# Altium project SmartWater.PrjPcb
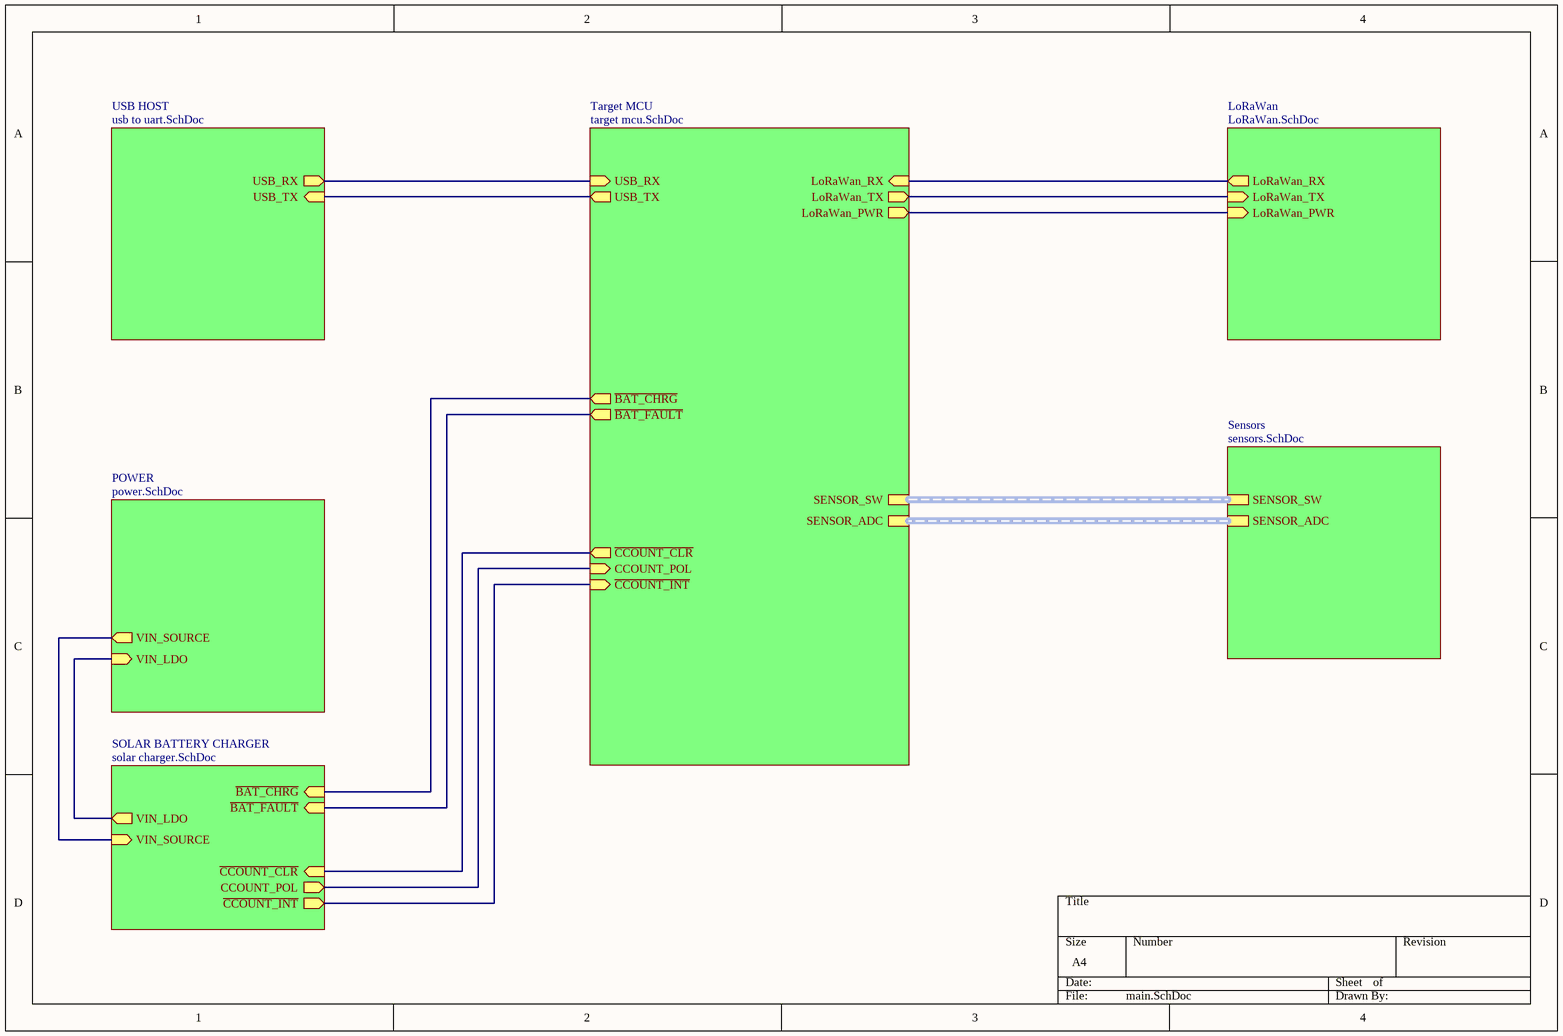
[diagram p0: main.SchDoc]
7 sheets, 122 parts. Net scope: hierarchical (ports join the sheet entries above them; power ports are global).
Board file: main.PcbDoc
Sheets:
  main.SchDoc
    Target MCU = target mcu.SchDoc
    USB HOST = usb to uart.SchDoc
    Sensors = sensors.SchDoc
    LoRaWan = LoRaWan.SchDoc
    POWER = power.SchDoc
    SOLAR BATTERY CHARGER = solar charger.SchDoc

## Sheet main.SchDoc
size A4

### Sub-sheets
LoRaWan = LoRaWan.SchDoc: LoRaWan_TX (in), LoRaWan_RX (out), LoRaWan_PWR (in)
POWER = power.SchDoc: VIN_SOURCE (out), VIN_LDO (in)
Sensors = sensors.SchDoc: SENSOR_ADC (harness SENSOR ADC), SENSOR_SW (harness SENSOR SWITCH)
SOLAR BATTERY CHARGER = solar charger.SchDoc: ~{CCOUNT_CLR} (in), ~{CCOUNT_INT} (out), VIN_SOURCE (in), VIN_LDO (out), ~{BAT_CHRG} (in), CCOUNT_POL (out), ~{BAT_FAULT} (in)
Target MCU = target mcu.SchDoc: SENSOR_SW (harness SENSOR SWITCH), LoRaWan_RX (in), SENSOR_ADC (harness SENSOR ADC), USB_TX (out), LoRaWan_TX (out), USB_RX (in), LoRaWan_PWR (out), ~{CCOUNT_CLR} (out), CCOUNT_POL (in), ~{CCOUNT_INT} (in), ~{BAT_CHRG} (out), ~{BAT_FAULT} (out)
USB HOST = usb to uart.SchDoc: USB_RX (out), USB_TX (in)

### Nets
CCOUNT+: sheet POWER/VIN_LDO, sheet SOLAR BATTERY CHARGER/VIN_LDO
CLR: sheet Target MCU/~{CCOUNT_CLR}, sheet SOLAR BATTERY CHARGER/~{CCOUNT_CLR}
INT: sheet Target MCU/~{CCOUNT_INT}, sheet SOLAR BATTERY CHARGER/~{CCOUNT_INT}
LoRa_RX: sheet Target MCU/LoRaWan_RX, sheet LoRaWan/LoRaWan_RX
LoRa_TX: sheet Target MCU/LoRaWan_TX, sheet LoRaWan/LoRaWan_TX
POL: sheet Target MCU/CCOUNT_POL, sheet SOLAR BATTERY CHARGER/CCOUNT_POL
Net*1_1: sheet Target MCU/LoRaWan_PWR, sheet LoRaWan/LoRaWan_PWR
NetC37_2: sheet POWER/VIN_SOURCE, sheet SOLAR BATTERY CHARGER/VIN_SOURCE
NetU1_1: sheet Target MCU/USB_RX, sheet USB HOST/USB_RX
NetU1_38: sheet Target MCU/~{BAT_FAULT}, sheet SOLAR BATTERY CHARGER/~{BAT_FAULT}
NetU1_39: sheet Target MCU/~{BAT_CHRG}, sheet SOLAR BATTERY CHARGER/~{BAT_CHRG}
NetU1_48: sheet Target MCU/USB_TX, sheet USB HOST/USB_TX

### Buses and harness runs
harness sheet Sensors/SENSOR_ADC = sheet Target MCU/SENSOR_ADC
harness sheet Sensors/SENSOR_SW = sheet Target MCU/SENSOR_SW

## Sheet target mcu.SchDoc
size A4
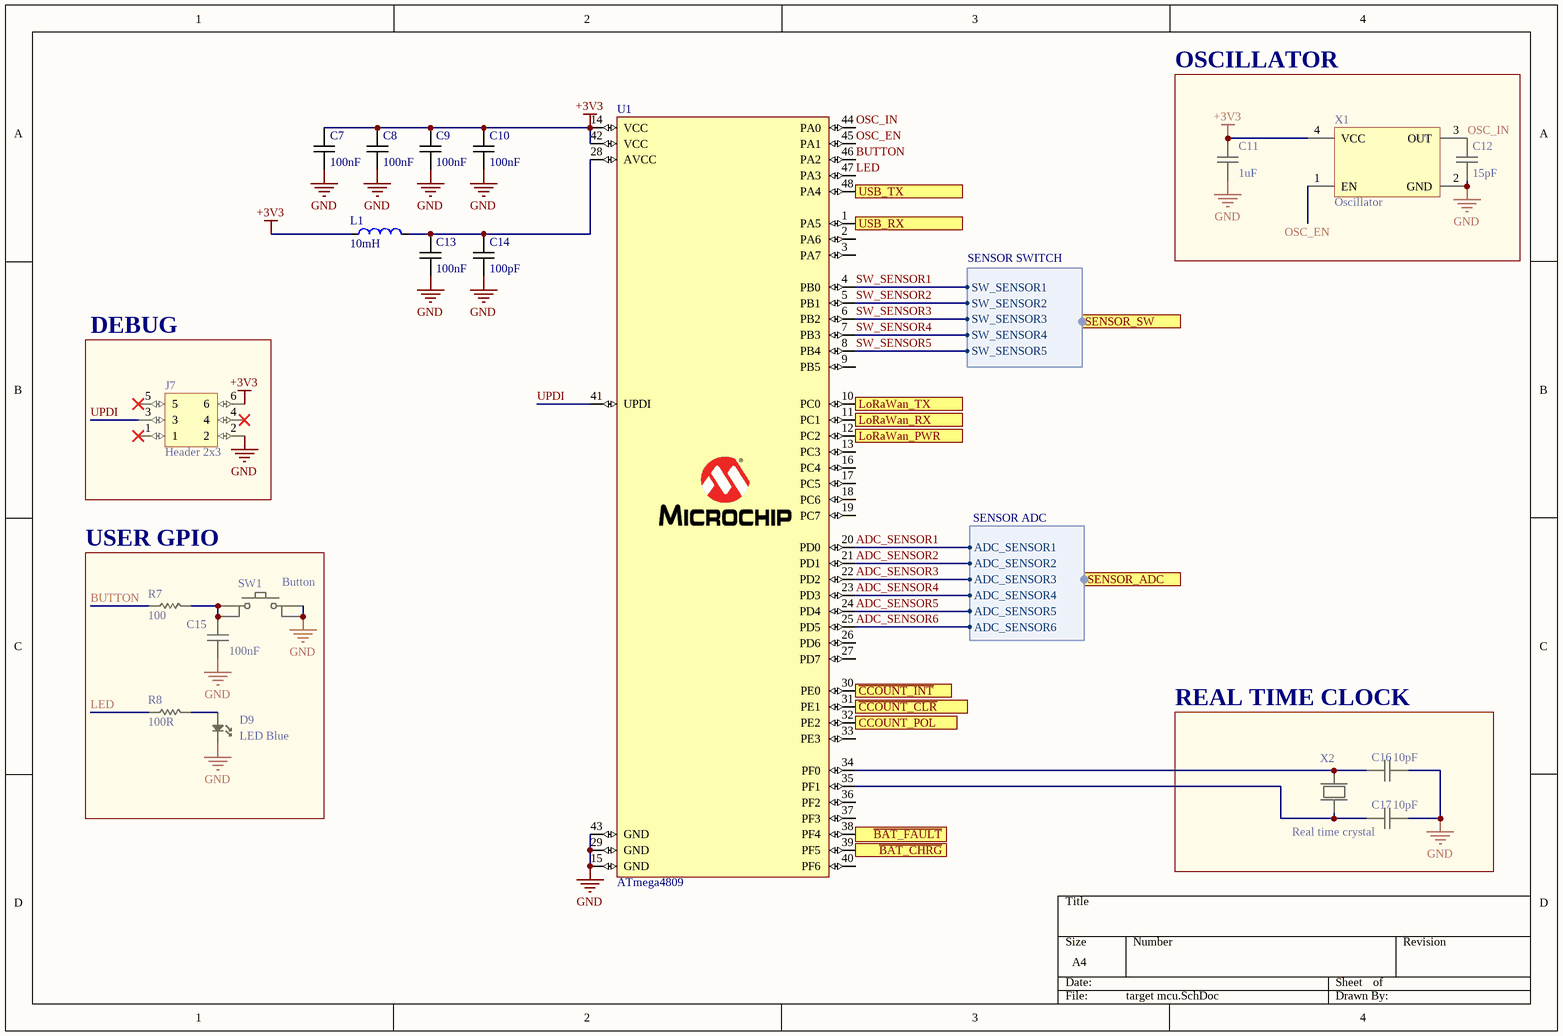
[diagram p1: target mcu.SchDoc]

### Parts
C7  value 100nF  [C0402]  (hidden comment: Capacitor 0402)
C8  value 100nF  [C0402]  (hidden comment: Capacitor 0402)
C9  value 100nF  [C0402]  (hidden comment: Capacitor 0402)
C10  value 100nF  [C0402]  (hidden comment: Capacitor 0402)
C11  value 1uF  [C0603]  (hidden comment: Capacitor 0603)
C12  value 15pF  [C0603]  (hidden comment: Capacitor 0603)
C13  value 100nF  [C0402]  (hidden comment: Capacitor 0402)
C14  value 100pF  [C0402]  (hidden comment: Capacitor 0402)
C15  value 100nF  [C0603]  (hidden comment: Capacitor 0603)
C16  value 10pF  [C0603]  (hidden comment: Capacitor 0603)
C17  value 10pF  [C0603]  (hidden comment: Capacitor 0603)
D9  LED Blue  [L0603 BLUE]
J7  Header 2x3  [Header 2x3 Male]
L1  value 10mH  [Inductor 0603]  (hidden comment: Inductor 0603)
R7  value 100  [R0603]  (hidden comment: Resistor 0603)
R8  value 100R  [R0603]  (hidden comment: Resistor 0603)
SW1  Button  [Button SMD]
U1  ATmega4809  [ATmega4809]
X1  Oscillator  [Crystal SMD 3.2x2.5]
X2  Real time crystal  [Realtime crystal SMD 4.2x1.45mm]

### Blocks framed on the sheet
OSCILLATOR: C11 C12 X1
DEBUG: J7
USER GPIO: C15 D9 R7 R8 SW1
REAL TIME CLOCK: C16 C17 X2

### Ports
CCOUNT_POL (in), LoRaWan_PWR (out), LoRaWan_RX (in), LoRaWan_TX (out), SENSOR_ADC (harness SENSOR ADC), SENSOR_SW (harness SENSOR SWITCH), USB_RX (in), USB_TX (out), ~{BAT_CHRG} (out), ~{BAT_FAULT} (out), ~{CCOUNT_CLR} (out), ~{CCOUNT_INT} (in)

### Harnesses
SENSOR SWITCH: SW_SENSOR1, SW_SENSOR2, SW_SENSOR3, SW_SENSOR4, SW_SENSOR5
SENSOR ADC: ADC_SENSOR1, ADC_SENSOR2, ADC_SENSOR3, ADC_SENSOR4, ADC_SENSOR5, ADC_SENSOR6

### Nets
+3V3: C7.2 C8.2 C9.2 C10.2 C11.2 J7.6 L1.1 U1.14(VCC) U1.42(VCC) X1.4(VCC)
GND: C7.1 C8.1 C9.1 C10.1 C11.1 C12.1 C13.1 C14.1 C15.1 C16.2 C17.2 D9.2 J7.2 SW1.3 SW1.4 U1.15(GND) U1.29(GND) U1.43(GND) X1.2(GND)
ADC_SENSOR1: U1.20(PD0) ; port SENSOR_ADC.ADC_SENSOR1
ADC_SENSOR2: U1.21(PD1) ; port SENSOR_ADC.ADC_SENSOR2
ADC_SENSOR3: U1.22(PD2) ; port SENSOR_ADC.ADC_SENSOR3
ADC_SENSOR4: U1.23(PD3) ; port SENSOR_ADC.ADC_SENSOR4
ADC_SENSOR5: U1.24(PD4) ; port SENSOR_ADC.ADC_SENSOR5
ADC_SENSOR6: U1.25(PD5) ; port SENSOR_ADC.ADC_SENSOR6
BUTTON: R7.1 U1.46(PA2)
CLR: U1.31(PE1) ; port ~{CCOUNT_CLR}
INT: U1.30(PE0) ; port ~{CCOUNT_INT}
LED: R8.1 U1.47(PA3)
LoRa_RX: U1.11(PC1) ; port LoRaWan_RX
LoRa_TX: U1.10(PC0) ; port LoRaWan_TX
OSC_EN: U1.45(PA1) X1.1(EN)
OSC_IN: C12.2 U1.44(PA0) X1.3(OUT)
POL: U1.32(PE2) ; port CCOUNT_POL
SW_SENSOR1: U1.4(PB0) ; port SENSOR_SW.SW_SENSOR1
SW_SENSOR2: U1.5(PB1) ; port SENSOR_SW.SW_SENSOR2
SW_SENSOR3: U1.6(PB2) ; port SENSOR_SW.SW_SENSOR3
SW_SENSOR4: U1.7(PB3) ; port SENSOR_SW.SW_SENSOR4
SW_SENSOR5: U1.8(PB4) ; port SENSOR_SW.SW_SENSOR5
UPDI: J7.3 U1.41(UPDI)
Net*1_1: U1.12(PC2) ; port LoRaWan_PWR
NetC13_2: C13.2 C14.2 L1.2 U1.28(AVCC)
NetC15_2: C15.2 R7.2 SW1.1 SW1.2
NetC16_1: C16.1 U1.34(PF0) X2.2
NetC17_1: C17.1 U1.35(PF1) X2.1
NetD9_1: D9.1 R8.2
NetU1_1: U1.1(PA5) ; port USB_RX
NetU1_38: U1.38(PF4) ; port ~{BAT_FAULT}
NetU1_39: U1.39(PF5) ; port ~{BAT_CHRG}
NetU1_48: U1.48(PA4) ; port USB_TX

Not connected (* = marked no-connect by the designer): J7 1* 4* 5*; U1 2(PA6) 3(PA7) 9(PB5) 13(PC3) 16(PC4) 17(PC5) 18(PC6) 19(PC7) 26(PD6) 27(PD7) 33(PE3) 36(PF2) 37(PF3) 40(PF6)

### Library data of the parts
D9 = LED 0603 Blue
J7 = Header  2x3 Male
SW1 = Button SMD
X1 = Oscillator 3.2x2.5mm
X2 = Realtime crystal SMD 5.2x1.45mm

## Sheet usb to uart.SchDoc
size A4
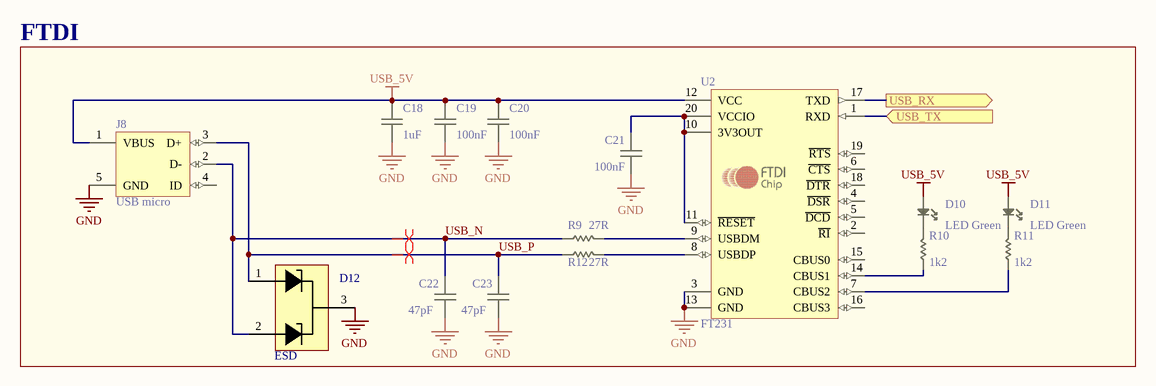
[diagram p2: usb to uart.SchDoc]

### Parts
C18  value 1uF  [C0603]  (hidden comment: Capacitor 0603)
C19  value 100nF  [C0603]  (hidden comment: Capacitor 0603)
C20  value 100nF  [C0603]  (hidden comment: Capacitor 0603)
C21  value 100nF  [C0603]  (hidden comment: Capacitor 0603)
C22  value 47pF  [C0603]  (hidden comment: Capacitor 0603)
C23  value 47pF  [C0603]  (hidden comment: Capacitor 0603)
D10  LED Green  [L0603 GREEN]
D11  LED Green  [L0603 GREEN]
D12  ESD  [ESD protection]
J8  USB micro  [USB micro]
R9  value 27R  [R0603]  (hidden comment: Resistor 0603)
R10  value 1k2  [R0603]  (hidden comment: Resistor 0603)
R11  value 1k2  [R0603]  (hidden comment: Resistor 0603)
R12  value 27R  [R0603]  (hidden comment: Resistor 0603)
U2  FT231  [FTDI]

### Blocks framed on the sheet
FTDI: C18-C23 D10-D12 J8 R9-R12 U2

### Ports
USB_RX (out), USB_TX (in)

### Nets
GND: C18.1 C19.1 C20.1 C21.1 C22.1 C23.1 D12.3 J8.5(GND) U2.3(GND) U2.13(GND)
USB_5V: C18.2 C19.2 C20.2 D10.1 D11.1 J8.1(VBUS) U2.12(VCC)
USB_N: C22.2 D12.2 J8.2(D-) R9.1
USB_P: C23.2 D12.1 J8.3(D+) R12.1
NetC21_2: C21.2 U2.10(3V3OUT) U2.11(~{RESET}) U2.20(VCCIO)
NetD10_2: D10.2 R10.2
NetD11_2: D11.2 R11.2
NetR9_2: R9.2 U2.9(USBDM)
NetR10_1: R10.1 U2.14(CBUS1)
NetR11_1: R11.1 U2.7(CBUS2)
NetR12_2: R12.2 U2.8(USBDP)
NetU1_1: U2.17(TXD) ; port USB_RX
NetU1_48: U2.1(RXD) ; port USB_TX

Not connected (* = marked no-connect by the designer): J8 4(ID); U2 2(~{RI}) 4(~{DSR}) 5(~{DCD}) 6(~{CTS}) 15(CBUS0) 16(CBUS3) 18(~{DTR}) 19(~{RTS})

### Layout directives
differential pair: USB_N, USB_P

### Library data of the parts
D10 D11 = LED 0603 Green
D12 = ESD protection 3.3V: PESD3V3S2UAT
U2 = FTDI: USB to UART

## Sheet sensors.SchDoc
size A4
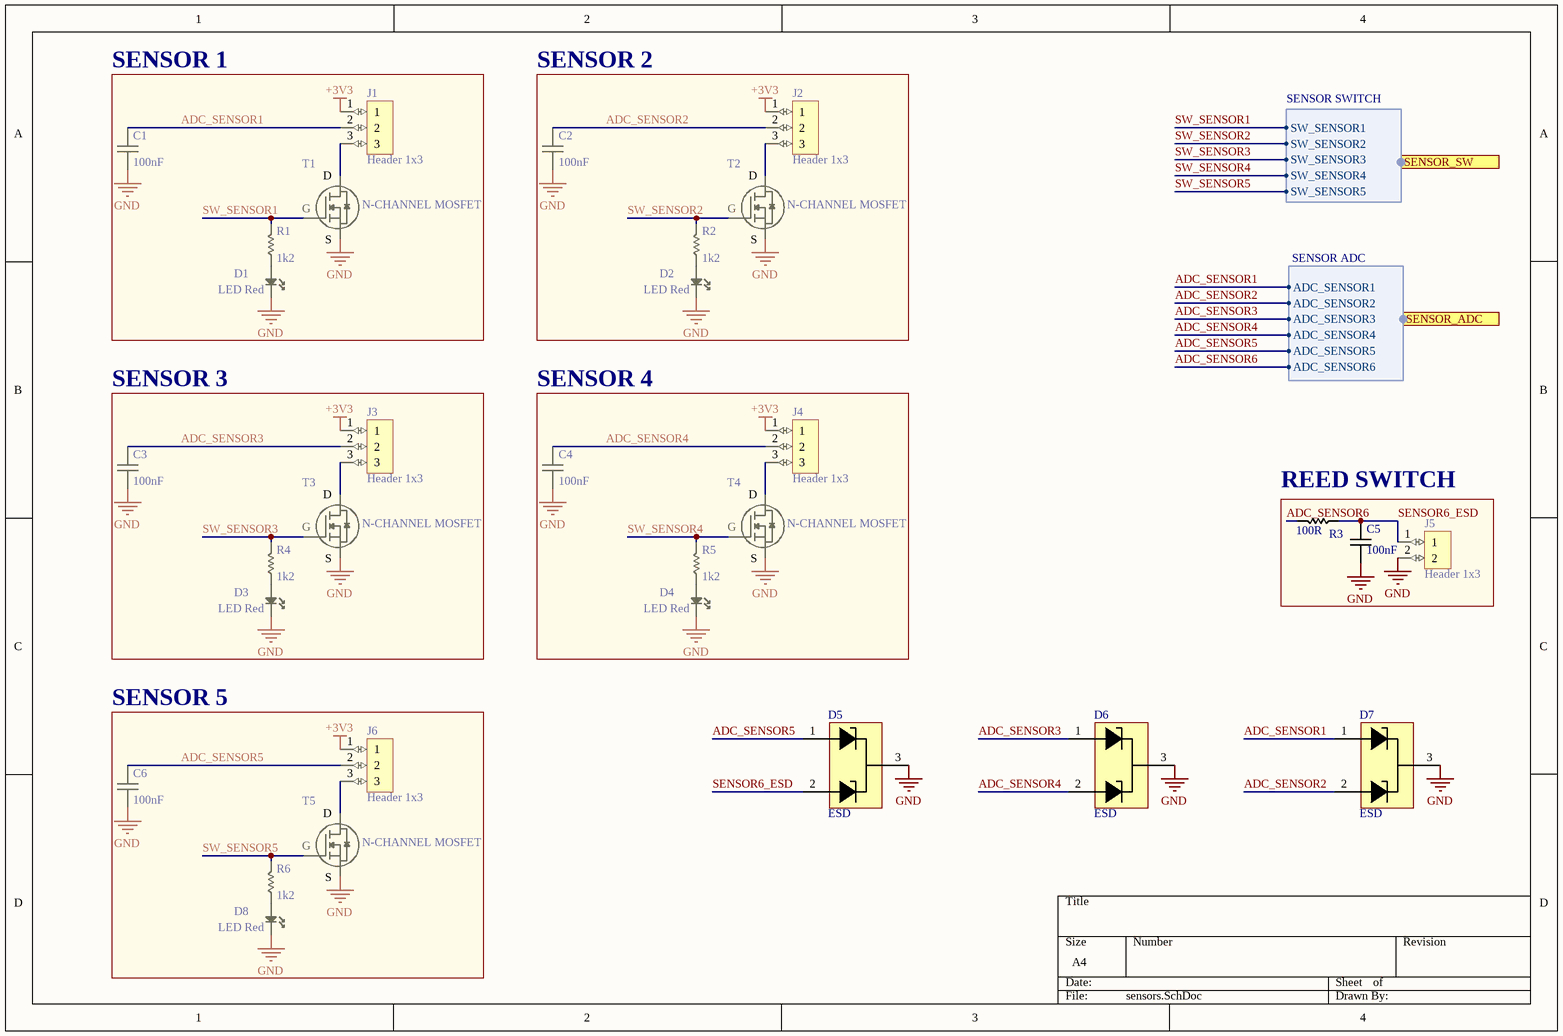
[diagram p3: sensors.SchDoc]

### Parts
C1  value 100nF  [C0402]  (hidden comment: Capacitor 0402)
C2  value 100nF  [C0402]  (hidden comment: Capacitor 0402)
C3  value 100nF  [C0402]  (hidden comment: Capacitor 0402)
C4  value 100nF  [C0402]  (hidden comment: Capacitor 0402)
C5  value 100nF  [C0603]  (hidden comment: Capacitor 0603)
C6  value 100nF  [C0402]  (hidden comment: Capacitor 0402)
D1  LED Red  [L0603 RED]
D2  LED Red  [L0603 RED]
D3  LED Red  [L0603 RED]
D4  LED Red  [L0603 RED]
D5  ESD  [ESD protection]
D6  ESD  [ESD protection]
D7  ESD  [ESD protection]
D8  LED Red  [L0603 RED]
J1  Header 1x3  [Header 1x3 Male JST]
J2  Header 1x3  [Header 1x3 Male JST]
J3  Header 1x3  [Header 1x3 Male JST]
J4  Header 1x3  [Header 1x3 Male JST]
J5  Header 1x3  [HEADER 1X2 MALE JST]
J6  Header 1x3  [Header 1x3 Male JST]
R1  value 1k2  [R0603]  (hidden comment: Resistor 0603)
R2  value 1k2  [R0603]  (hidden comment: Resistor 0603)
R3  value 100R  [R0603]  (hidden comment: Resistor 0603)
R4  value 1k2  [R0603]  (hidden comment: Resistor 0603)
R5  value 1k2  [R0603]  (hidden comment: Resistor 0603)
R6  value 1k2  [R0603]  (hidden comment: Resistor 0603)
T1  N-CHANNEL MOSFET  [2N7002]
T2  N-CHANNEL MOSFET  [2N7002]
T3  N-CHANNEL MOSFET  [2N7002]
T4  N-CHANNEL MOSFET  [2N7002]
T5  N-CHANNEL MOSFET  [2N7002]

### Blocks framed on the sheet
SENSOR 1: C1 D1 J1 R1 T1
SENSOR 2: C2 D2 J2 R2 T2
SENSOR 3: C3 D3 J3 R4 T3
SENSOR 4: C4 D4 J4 R5 T4
REED SWITCH: C5 J5 R3
SENSOR 5: C6 D8 J6 R6 T5

### Ports
SENSOR_ADC (harness SENSOR ADC), SENSOR_SW (harness SENSOR SWITCH)

### Harnesses
SENSOR SWITCH: SW_SENSOR1, SW_SENSOR2, SW_SENSOR3, SW_SENSOR4, SW_SENSOR5
SENSOR ADC: ADC_SENSOR1, ADC_SENSOR2, ADC_SENSOR3, ADC_SENSOR4, ADC_SENSOR5, ADC_SENSOR6

### Nets
+3V3: J1.1 J2.1 J3.1 J4.1 J6.1
GND: C1.1 C2.1 C3.1 C4.1 C5.1 C6.1 D1.2 D2.2 D3.2 D4.2 D5.3 D6.3 D7.3 D8.2 J5.2 T1.2(S) T2.2(S) T3.2(S) T4.2(S) T5.2(S)
ADC_SENSOR1: C1.2 D7.1 J1.2 ; port SENSOR_ADC.ADC_SENSOR1
ADC_SENSOR2: C2.2 D7.2 J2.2 ; port SENSOR_ADC.ADC_SENSOR2
ADC_SENSOR3: C3.2 D6.1 J3.2 ; port SENSOR_ADC.ADC_SENSOR3
ADC_SENSOR4: C4.2 D6.2 J4.2 ; port SENSOR_ADC.ADC_SENSOR4
ADC_SENSOR5: C6.2 D5.1 J6.2 ; port SENSOR_ADC.ADC_SENSOR5
ADC_SENSOR6: R3.2 ; port SENSOR_ADC.ADC_SENSOR6
SENSOR6_ESD: C5.2 D5.2 J5.1 R3.1
SW_SENSOR1: R1.2 T1.1(G) ; port SENSOR_SW.SW_SENSOR1
SW_SENSOR2: R2.2 T2.1(G) ; port SENSOR_SW.SW_SENSOR2
SW_SENSOR3: R4.2 T3.1(G) ; port SENSOR_SW.SW_SENSOR3
SW_SENSOR4: R5.2 T4.1(G) ; port SENSOR_SW.SW_SENSOR4
SW_SENSOR5: R6.2 T5.1(G) ; port SENSOR_SW.SW_SENSOR5
NetD1_1: D1.1 R1.1
NetD2_1: D2.1 R2.1
NetD3_1: D3.1 R4.1
NetD4_1: D4.1 R5.1
NetD8_1: D8.1 R6.1
NetJ1_3: J1.3 T1.3(D)
NetJ2_3: J2.3 T2.3(D)
NetJ3_3: J3.3 T3.3(D)
NetJ4_3: J4.3 T4.3(D)
NetJ6_3: J6.3 T5.3(D)

### Library data of the parts
D1-D4 D8 = LED 0603 Red
D5-D7 = ESD protection 3.3V: PESD3V3S2UAT
J1-J4 J6 = Header 1x3 Male
J5 = Header 1x2 Male
T1-T5 = 2N7002

## Sheet LoRaWan.SchDoc
size A4
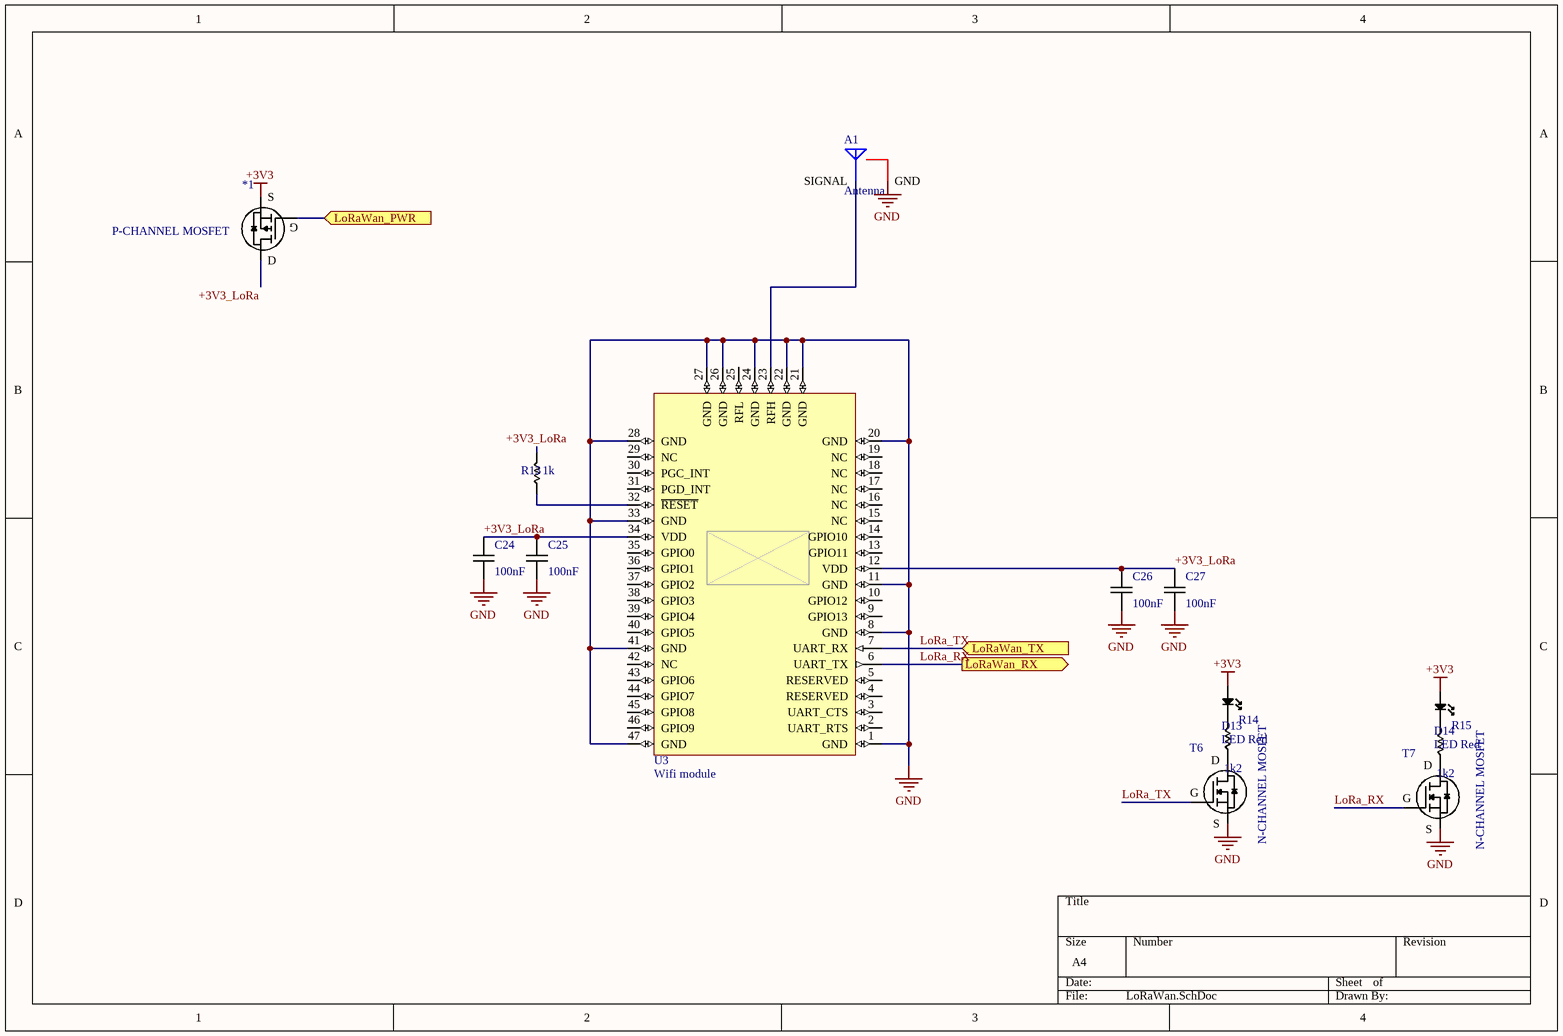
[diagram p4: LoRaWan.SchDoc]

### Parts
*1  P-CHANNEL MOSFET  [P-CHANNEL MOSFET]
A1  Antenna  [uFL SMD]
C24  value 100nF  [C0603]  (hidden comment: Capacitor 0603)
C25  value 100nF  [C0603]  (hidden comment: Capacitor 0603)
C26  value 100nF  [C0603]  (hidden comment: Capacitor 0603)
C27  value 100nF  [C0603]  (hidden comment: Capacitor 0603)
D13  LED Red  [L0603 RED]
D14  LED Red  [L0603 RED]
R13  value 1k  [R0603]  (hidden comment: Resistor 0603)
R14  value 1k2  [R0603]  (hidden comment: Resistor 0603)
R15  value 1k2  [R0603]  (hidden comment: Resistor 0603)
T6  N-CHANNEL MOSFET  [2N7002]
T7  N-CHANNEL MOSFET  [2N7002]
U3  Wifi module  [RN2483A]

### Ports
LoRaWan_PWR (in), LoRaWan_RX (out), LoRaWan_TX (in)

### Nets
+3V3: *1.2(S) D13.1 D14.1
GND: A1.2(GND) C24.1 C25.1 C26.1 C27.1 T6.2(S) T7.2(S) U3.1(GND) U3.8(GND) U3.11(GND) U3.20(GND) U3.21(GND) U3.22(GND) U3.24(GND) U3.26(GND) U3.27(GND) U3.28(GND) U3.33(GND) U3.41(GND) U3.47(GND)
+3V3_LoRa: *1.3(D) C24.2 C25.2 C26.2 C27.2 R13.2 U3.12(VDD) U3.34(VDD)
LoRa_RX: T7.1(G) U3.6(UART_TX) ; port LoRaWan_RX
LoRa_TX: T6.1(G) U3.7(UART_RX) ; port LoRaWan_TX
Net*1_1: *1.1(G) ; port LoRaWan_PWR
NetA1_1: A1.1(SIGNAL) U3.23(RFH)
NetD13_2: D13.2 R14.2
NetD14_2: D14.2 R15.2
NetR13_1: R13.1 U3.32(~{RESET})
NetR14_1: R14.1 T6.3(D)
NetR15_1: R15.1 T7.3(D)

Not connected (* = marked no-connect by the designer): U3 2(UART_RTS) 3(UART_CTS) 4(RESERVED) 5(RESERVED) 9(GPIO13) 10(GPIO12) 13(GPIO11) 14(GPIO10) 15(NC) 16(NC) 17(NC) 18(NC) 19(NC) 25(RFL) 29(NC) 30(PGC_INT) 31(PGD_INT) 35(GPIO0) 36(GPIO1) 37(GPIO2) 38(GPIO3) 39(GPIO4) 40(GPIO5) 42(NC) 43(GPIO6) 44(GPIO7) 45(GPIO8) 46(GPIO9)

### Library data of the parts
A1 = uFL SMD
D13 D14 = LED 0603 Red
T6 T7 = 2N7002
U3 = LoRaWan module: RN2483A

## Sheet power.SchDoc
size A4
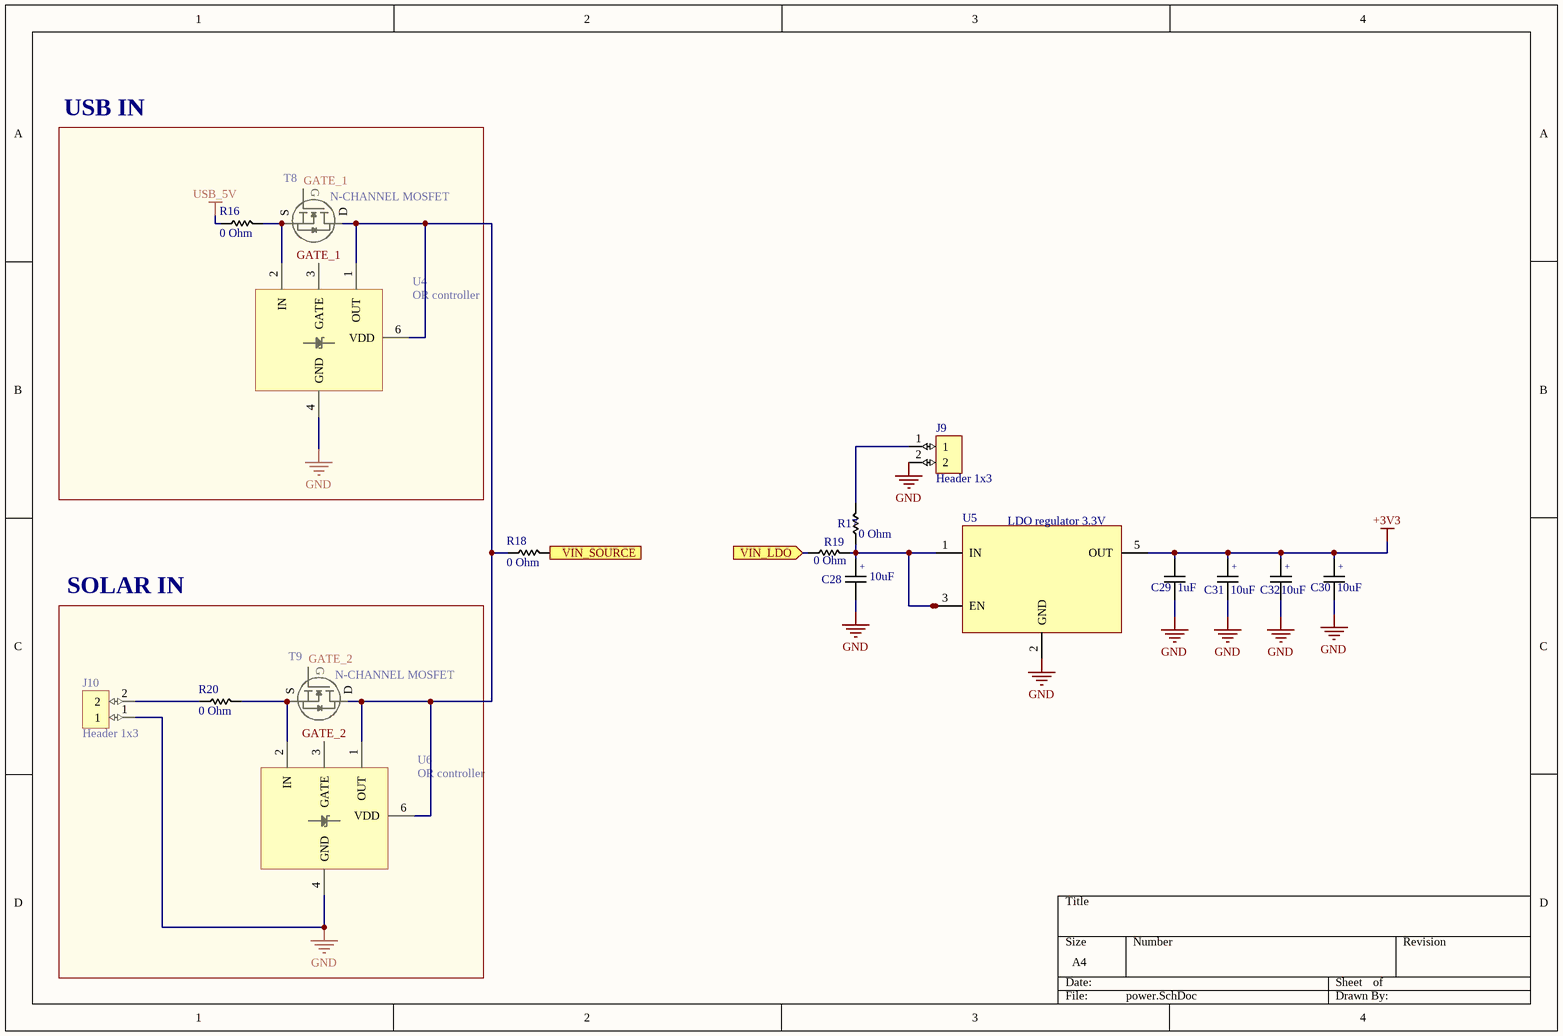
[diagram p5: power.SchDoc]

### Parts
C28  value 10uF  [Capacitor electrolytic SMD 4x5.4]  (hidden comment: El. Capacitor SMD 4x5.4)
C29  value 1uF  [C0603]  (hidden comment: Capacitor 0603)
C30  value 10uF  [Capacitor electrolytic SMD 4x5.4]  (hidden comment: El. Capacitor SMD 4x5.4)
C31  value 10uF  [Capacitor electrolytic SMD 4x5.4]  (hidden comment: El. Capacitor SMD 4x5.4)
C32  value 10uF  [Capacitor electrolytic SMD 4x5.4]  (hidden comment: El. Capacitor SMD 4x5.4)
J9  Header 1x3  [HEADER 1X2 MALE JST]
J10  Header 1x3  [Header 1x2 Male]
R16  value 0 Ohm  [R0603]  (hidden comment: Resistor 0603)
R17  value 0 Ohm  [R0603]  (hidden comment: Resistor 0603)
R18  value 0 Ohm  [R0603]  (hidden comment: Resistor 0603)
R19  value 0 Ohm  [R0603]  (hidden comment: Resistor 0603)
R20  value 0 Ohm  [R0603]  (hidden comment: Resistor 0603)
T8  N-CHANNEL MOSFET  [N-CHANNEL MOSFET]
T9  N-CHANNEL MOSFET  [N-CHANNEL MOSFET]
U4  OR controller  [DFN 6-pins]
U5  LDO regulator 3.3V  [LDO 5-pin SOT]
U6  OR controller  [DFN 6-pins]

### Blocks framed on the sheet
USB IN: R16 T8 U4
SOLAR IN: J10 R20 T9 U6

### Ports
VIN_LDO (in), VIN_SOURCE (out)

### Nets
+3V3: C29.2 C30.1 C31.1 C32.1 U5.5(OUT)
GND: C28.2 C29.1 C30.2 C31.2 C32.2 J9.2 J10.1 U4.4(GND) U5.2(GND) U6.4(GND)
USB_5V: R16.1
CCOUNT+: R19.1 ; port VIN_LDO
GATE_1: T8.1(G) U4.3(GATE)
GATE_2: T9.1(G) U6.3(GATE)
NetC28_1: C28.1 R17.1 R19.2 U5.1(IN) U5.3(EN)
NetC37_2: R18.2 ; port VIN_SOURCE
NetJ9_1: J9.1 R17.2
NetJ10_2: J10.2 R20.1
NetR16_2: R16.2 T8.2(S) U4.2(IN)
NetR18_1: R18.1 T8.3(D) T9.3(D) U4.1(OUT) U4.6(VDD) U6.1(OUT) U6.6(VDD)
NetR20_2: R20.2 T9.2(S) U6.2(IN)

### Notes on the sheet
- (in symbol El. Capacitor SMD 4x5.4) +

### Library data of the parts
J9 J10 = Header 1x2 Male
U4 U6 = OR controller: LTC4357
U5 = TLV700 - 3.3V

## Sheet solar charger.SchDoc
size A4
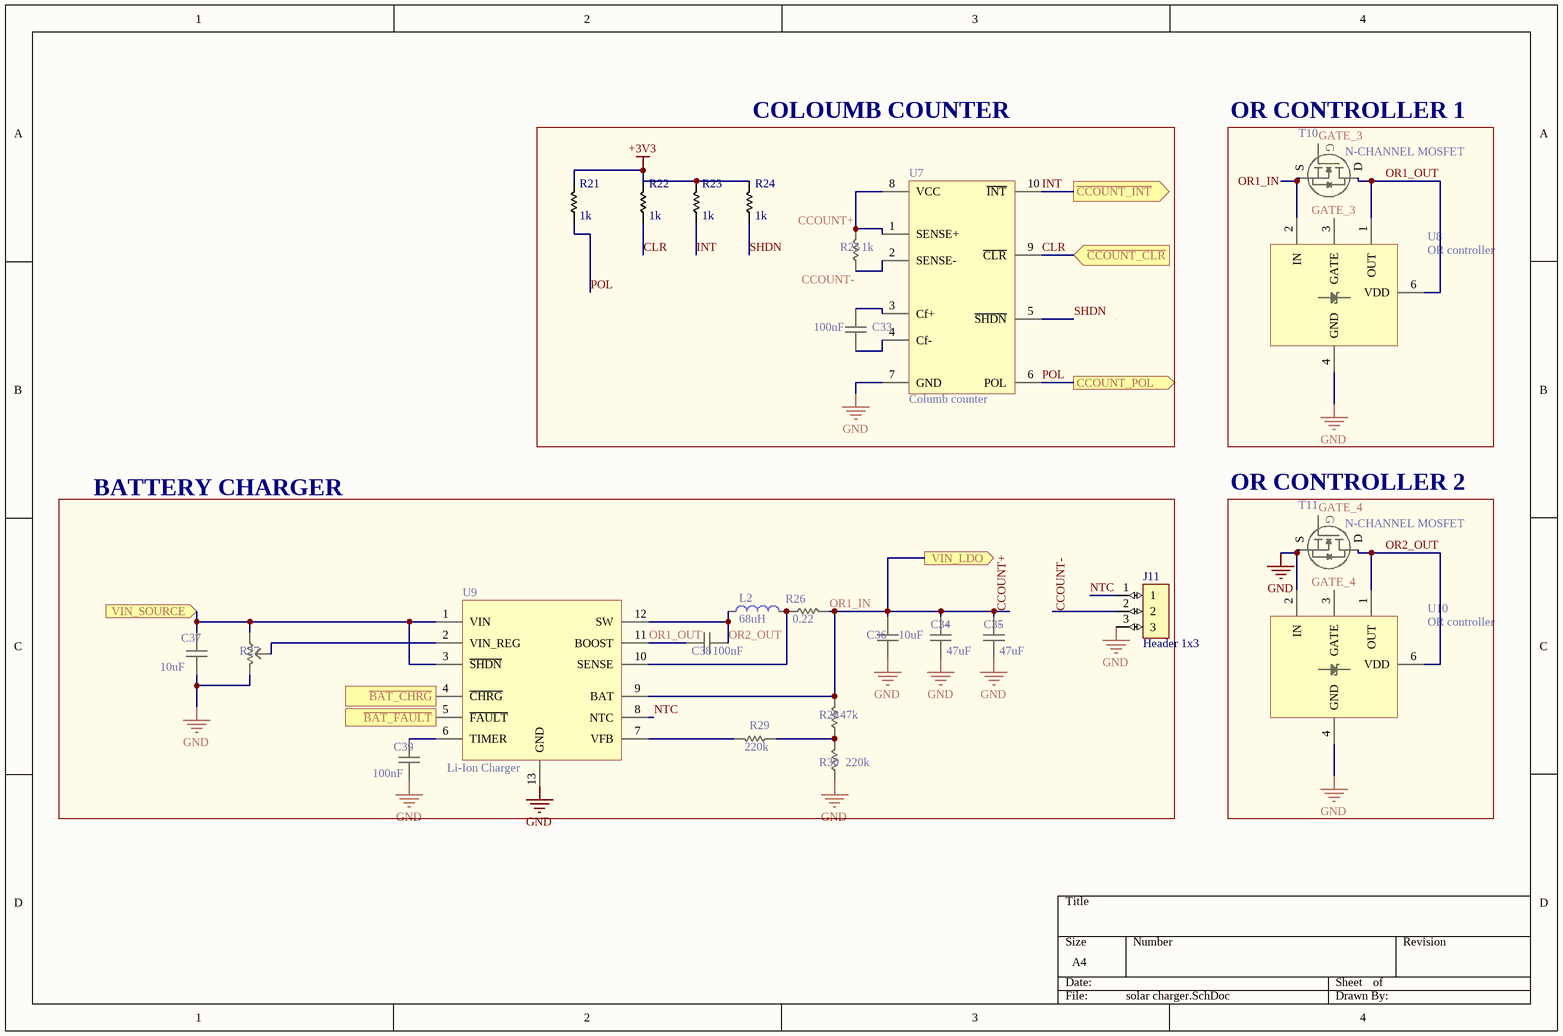
[diagram p6: solar charger.SchDoc]

### Parts
C33  value 100nF  [C0603]  (hidden comment: Capacitor 0603)
C34  value 47uF  [Capacitor electrolytic SMD 5x5.4]  (hidden comment: El. Capacitor SMD 5x5.4)
C35  value 47uF  [Capacitor electrolytic SMD 5x5.4]  (hidden comment: El. Capacitor SMD 5x5.4)
C36  value 10uF  [C0805]  (hidden comment: Capacitor 0805)
C37  value 10uF  [C0805]  (hidden comment: Capacitor 0805)
C38  value 100nF  [C0603]  (hidden comment: Capacitor 0603)
C39  value 100nF  [C0603]  (hidden comment: Capacitor 0603)
J11  Header 1x3  [Header 1x3 Male JST]
L2  value 68uH  [Inductor 1515]  (hidden comment: Inductor 1515)
R21  value 1k  [R0603]  (hidden comment: Resistor 0603)
R22  value 1k  [R0603]  (hidden comment: Resistor 0603)
R23  value 1k  [R0603]  (hidden comment: Resistor 0603)
R24  value 1k  [R0603]  (hidden comment: Resistor 0603)
R25  value 1k  [R0603]  (hidden comment: Resistor 0603)
R26  value 0.22  [R0603]  (hidden comment: Resistor 0603)
R27  Potentiometer  [Potentiometer 0505]  (value not drawn)
R28  value 47k  [R0603]  (hidden comment: Resistor 0603)
R29  value 220k  [R0603]  (hidden comment: Resistor 0603)
R30  value 220k  [R0603]  (hidden comment: Resistor 0603)
T10  N-CHANNEL MOSFET  [N-CHANNEL MOSFET]
T11  N-CHANNEL MOSFET  [N-CHANNEL MOSFET]
U7  Columb counter  [LTC4150]
U8  OR controller  [DFN 6-pins]
U9  Li-Ion Charger  [DFN 12-PINS]
U10  OR controller  [DFN 6-pins]

### Blocks framed on the sheet
COLOUMB COUNTER: C33 R21-R25 U7
OR CONTROLLER 1: T10 U8
BATTERY CHARGER: C34-C39 J11 L2 R26-R30 U9
OR CONTROLLER 2: T11 U10

### Ports
CCOUNT_POL (out), VIN_LDO (out), VIN_SOURCE (in), ~{BAT_CHRG} (in), ~{BAT_FAULT} (in), ~{CCOUNT_CLR} (in), ~{CCOUNT_INT} (out)

### Nets
+3V3: R21.2 R22.2 R23.2 R24.2
GND: C34.2 C35.2 C36.1 C37.1 C39.1 J11.3 R27.3 R30.1 T11.2(S) U7.7(GND) U8.4(GND) U9.13(GND) U10.2(IN) U10.4(GND)
CCOUNT+: C34.1 C35.1 C36.2 R25.2 R26.2 R28.2 T10.2(S) U7.1(SENSE+) U7.8(VCC) U8.2(IN) U9.9(BAT) ; port VIN_LDO  [also labelled OR1_IN]
CCOUNT-: J11.2 R25.1 U7.2(SENSE-)
CLR: R22.1 U7.9(~{CLR}) ; port ~{CCOUNT_CLR}
GATE_3: T10.1(G) U8.3(GATE)
GATE_4: T11.1(G) U10.3(GATE)
INT: R23.1 U7.10(~{INT}) ; port ~{CCOUNT_INT}
NTC: J11.1 U9.8(NTC)
OR1_OUT: C38.1 T10.3(D) U8.1(OUT) U8.6(VDD) U9.11(BOOST)
OR2_OUT: C38.2 L2.1 T11.3(D) U9.12(SW) U10.1(OUT) U10.6(VDD)
POL: R21.1 U7.6(POL) ; port CCOUNT_POL
SHDN: R24.1 U7.5(~{SHDN})
NetC33_1: C33.1 U7.4(Cf-)
NetC33_2: C33.2 U7.3(Cf+)
NetC37_2: C37.2 R27.1 U9.1(VIN) U9.3(~{SHDN}) ; port VIN_SOURCE
NetC39_2: C39.2 U9.6(TIMER)
NetL2_2: L2.2 R26.1 U9.10(SENSE)
NetR27_2: R27.2 U9.2(VIN_REG)
NetR28_1: R28.1 R29.1 R30.2
NetR29_2: R29.2 U9.7(VFB)
NetU1_38: U9.5(~{FAULT}) ; port ~{BAT_FAULT}
NetU1_39: U9.4(~{CHRG}) ; port ~{BAT_CHRG}

### Notes on the sheet
- (in symbol El. Capacitor SMD 5x5.4) +

### Library data of the parts
J11 = Header 1x3 Male
L2 = Inductor 1515: type: MSS1583-683MED
R27 = Potentiometer 0505
U7 = Coulomb counter
U8 U10 = OR controller: LTC4357
U9 = Litium battery charger

## Nets that join several sheets
+3V3: target mcu (10 pins), sensors (5 pins), LoRaWan (*1.2 D13.1 D14.1), power (5 pins), solar charger (R21.2 R22.2 R23.2 R24.2)
GND: target mcu (19 pins), usb to uart (10 pins), sensors (20 pins), LoRaWan (20 pins), power (10 pins), solar charger (14 pins)
USB_5V: usb to uart (7 pins), power (R16.1)
ADC_SENSOR1: target mcu (U1.20), sensors (C1.2 D7.1 J1.2)
ADC_SENSOR2: target mcu (U1.21), sensors (C2.2 D7.2 J2.2)
ADC_SENSOR3: target mcu (U1.22), sensors (C3.2 D6.1 J3.2)
ADC_SENSOR4: target mcu (U1.23), sensors (C4.2 D6.2 J4.2)
ADC_SENSOR5: target mcu (U1.24), sensors (C6.2 D5.1 J6.2)
ADC_SENSOR6: target mcu (U1.25), sensors (R3.2)
CCOUNT+: power (R19.1), solar charger (11 pins)
CLR: target mcu (U1.31), solar charger (R22.1 U7.9)
INT: target mcu (U1.30), solar charger (R23.1 U7.10)
LoRa_RX: target mcu (U1.11), LoRaWan (T7.1 U3.6)
LoRa_TX: target mcu (U1.10), LoRaWan (T6.1 U3.7)
Net*1_1: target mcu (U1.12), LoRaWan (*1.1)
NetC37_2: power (R18.2), solar charger (C37.2 R27.1 U9.1 U9.3)
NetU1_1: target mcu (U1.1), usb to uart (U2.17)
NetU1_38: target mcu (U1.38), solar charger (U9.5)
NetU1_39: target mcu (U1.39), solar charger (U9.4)
NetU1_48: target mcu (U1.48), usb to uart (U2.1)
POL: target mcu (U1.32), solar charger (R21.1 U7.6)
SW_SENSOR1: target mcu (U1.4), sensors (R1.2 T1.1)
SW_SENSOR2: target mcu (U1.5), sensors (R2.2 T2.1)
SW_SENSOR3: target mcu (U1.6), sensors (R4.2 T3.1)
SW_SENSOR4: target mcu (U1.7), sensors (R5.2 T4.1)
SW_SENSOR5: target mcu (U1.8), sensors (R6.2 T5.1)